# Altium schematic sheet Radio.SchDoc
size A3; DocumentNumber: 10; SheetNumber: 10; SheetTotal: 11
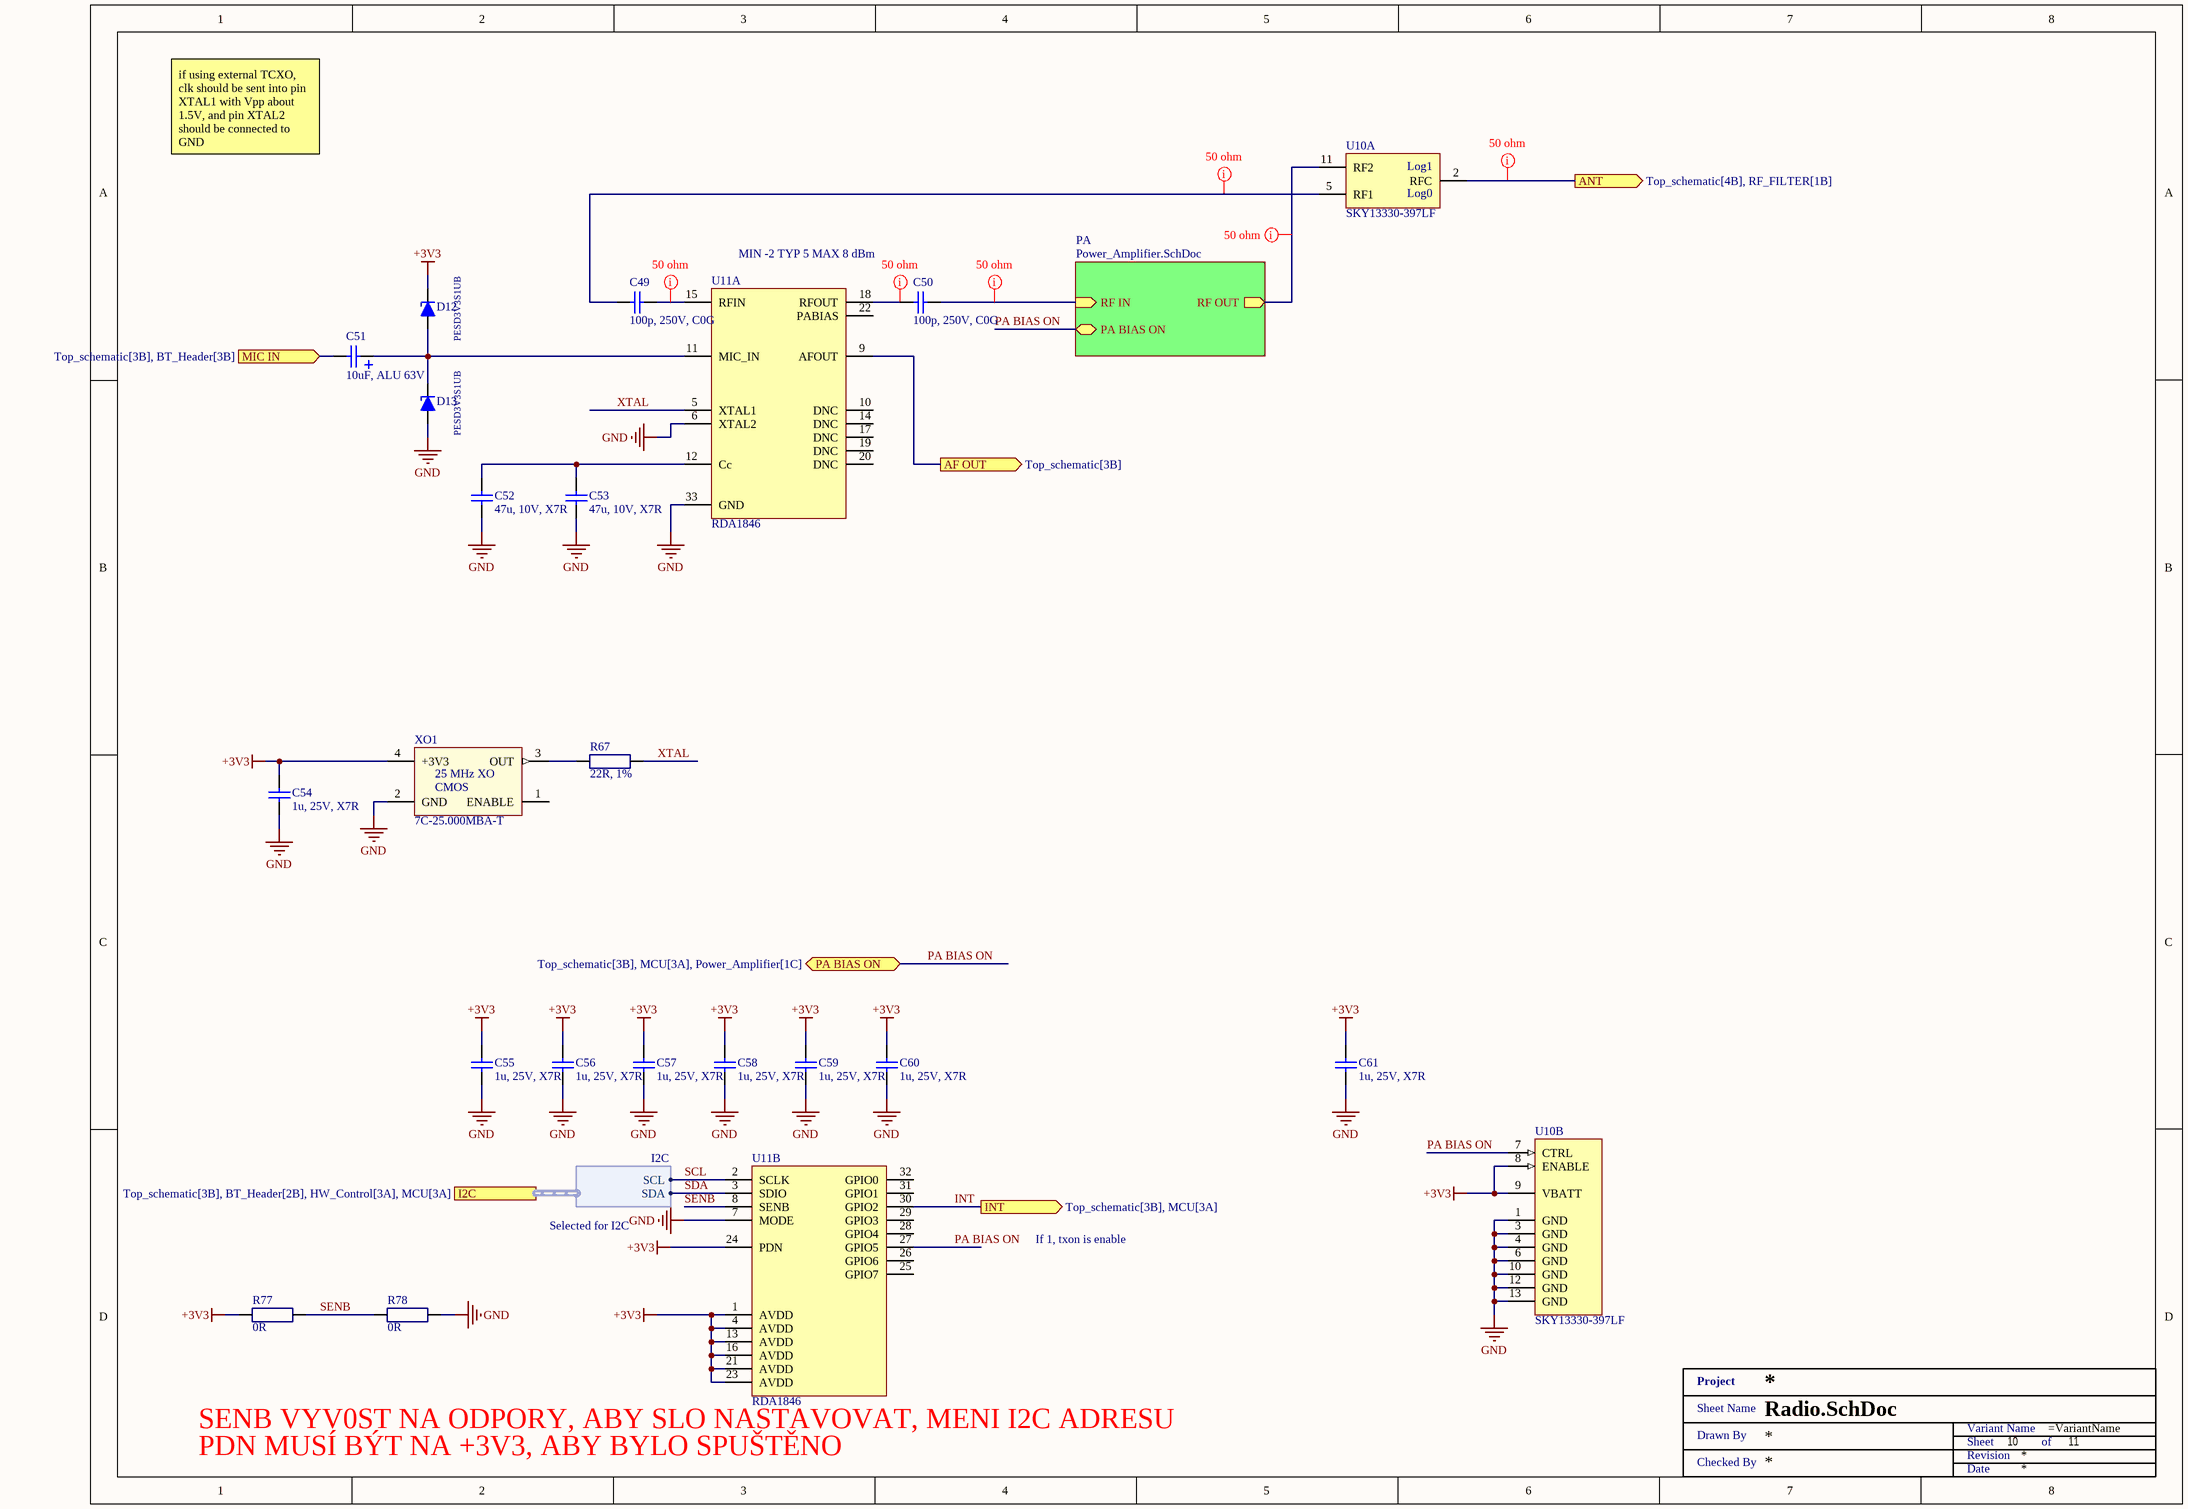
[diagram p0: Radio.SchDoc]

## Parts
C49  100p, 250V, C0G  [SMD0603]
C50  100p, 250V, C0G  [SMD0603]
C51  10uF, ALU 63V  [WCAP-ATLI_5x11x2]
C52  47u, 10V, X7R  [SMD1210]
C53  47u, 10V, X7R  [SMD1210]
C54  1u, 25V, X7R  [SMD0603]
C55  1u, 25V, X7R  [SMD0603]
C56  1u, 25V, X7R  [SMD0603]
C57  1u, 25V, X7R  [SMD0603]
C58  1u, 25V, X7R  [SMD0603]
C59  1u, 25V, X7R  [SMD0603]
C60  1u, 25V, X7R  [SMD0603]
C61  1u, 25V, X7R  [SMD0603]
D12  PESD3V3S1UB  [SOD523]
D13  PESD3V3S1UB  [SOD523]
R67  22R, 1%  [SMD0603 - R]
R77  0R  [SMD0603 - R]
R78  0R  [SMD0603 - R]
U10  SKY13330-397LF  [QFN50P200X200X100_HS-13N]  (parts A,B of 2)
U11  RDA1846  [QFN32-2]  (parts A,B of 2)
XO1  7C-25.000MBA-T  [ABRA-ABMM2-4_V]
XX?  Title 1  (value not drawn)  (graphical)

## Sub-sheets
PA = Power_Amplifier.SchDoc: PA BIAS ON (bidir), RF IN (in), RF OUT (out)

## Ports
AF OUT (out, see Top_schematic[3B]), ANT (out, see Top_schematic[4B], RF_FILTER[1B]), I2C (harness I2C, see Top_schematic[3B], BT_Header[2B], HW_Control[3A], MCU[3A]), INT (out, see Top_schematic[3B], MCU[3A]), MIC IN (in, see Top_schematic[3B], BT_Header[3B]), PA BIAS ON (bidir, see Top_schematic[3B], MCU[3A], Power_Amplifier[1C])

## Harnesses
I2C: SCL, SDA

## Nets
+3V3: C54.1 C55.1 C56.1 C57.1 C58.1 C59.1 C60.1 C61.1 D12.1(A) R77.1 U10.8(ENABLE) U10.9(VBATT) U11.1(AVDD) U11.4(AVDD) U11.13(AVDD) U11.16(AVDD) U11.21(AVDD) U11.23(AVDD) U11.24(PDN) XO1.4(+3V3)
GND: C52.1 C53.1 C54.2 C55.2 C56.2 C57.2 C58.2 C59.2 C60.2 C61.2 D13.2(K) R78.2 U10.1(GND) U10.3(GND) U10.4(GND) U10.6(GND) U10.10(GND) U10.12(GND) U10.13(GND) U11.6(XTAL2) U11.7(MODE) U11.33(GND) XO1.2(GND)
AF OUT: U11.9(AFOUT) ; port AF OUT
ANT: U10.2(RFC) ; port ANT
INT: U11.30(GPIO2) ; port INT
MIC IN: C51.2 ; port MIC IN
PA BIAS ON: U10.7(CTRL) U11.27(GPIO5) ; port PA BIAS ON, sheet PA/PA BIAS ON
SCL: U11.2(SCLK) ; port I2C.SCL
SDA: U11.3(SDIO) ; port I2C.SDA
SENB: R77.2 R78.1 U11.8(SENB)
XTAL: R67.2 U11.5(XTAL1)
NetC49_1: C49.1 U10.5(RF1)
NetC49_2: C49.2 U11.15(RFIN)
NetC50_1: C50.1 U11.18(RFOUT)
NetC50_2: C50.2 ; sheet PA/RF IN
NetC51_1: C51.1 D12.2(K) D13.1(A) U11.11(MIC_IN)
NetC52_2: C52.2 C53.2 U11.12(Cc)
NetR67_1: R67.1 XO1.3(OUT)
NetU10_11: U10.11(RF2) ; sheet PA/RF OUT

Not connected (* = marked no-connect by the designer): U11 10(DNC) 14(DNC) 17(DNC) 19(DNC) 20(DNC) 22(PABIAS) 25(GPIO7) 26(GPIO6) 28(GPIO4) 29(GPIO3) 31(GPIO1) 32(GPIO0); XO1 1(ENABLE)

## Layout directives
net class 50 ohm: ANT, NetC49_1, NetC49_2, NetC50_1, NetC50_2, NetU10_11

## Notes on the sheet
- if using external TCXO, clk should be sent into pin XTAL1 with Vpp about 1.5V, and pin XTAL2 should be connected to GND
- MIN -2 TYP 5 MAX 8 dBm
- Selected for I2C
- If 1, txon is enable
- (near U11) SENB VYV0ST NA ODPORY, ABY SLO NASTAVOVAT, MENI I2C ADRESU
- (near U11) PDN MUSÍ BÝT NA +3V3, ABY BYLO SPUŠTĚNO
- (in symbol 7C-25.000MBA-T) 25 MHz XO; CMOS
- (in symbol SKY13330-397LF, part A) Log1; Log0
- (in symbol Title 1) Project; Sheet Name; Variant Name; Drawn By; Sheet; of; Revision; Checked By; Date

## Library data of the parts
C49 C50 = 885342006003: CAP CER 100PF 250V C0G/NP0 0603; Manufacturer: Wurth Electronics Inc.; Tolerance: ±5%; Temperature Coefficient: C0G, NP0; Notification: Current market demand for these product types have resulted in fluctuating and extending lead times. Lead times may differ.; Supplier 1: Digi-Key; Supplier Part Number 1: 732-12167-1-ND; Manufacturer Part Number: 885342006003; RoHS: RoHS Compliant; Category: Capacitors; Stock 1: 43; Pricing 1: 1=0.1, 10=0.043, 100=0.0385, 500=0.03406 (USD); Packaging: Cut Tape (CT); Part Status: Active; Voltage - Rated: 250V; Operating Temperature: -55°C ~ 125°C; Features: -; Ratings: -; Applications: General Purpose; Failure Rate: -; Mounting Type: Surface Mount, MLCC; Package / Case: 0603 (1608 Metric); Size / Dimension: 0.063" L x 0.031" W (1.60mm x 0.80mm); Height - Seated (Max): -; Thickness (Max): 0.034" (0.87mm); Lead Spacing: -; Lead Style: -; ComponentLink1URL: https://katalog.we-online.de/pbs/datasheet/885342006003.pdf; ComponentLink1Description: https://katalog.we-online.de/pbs/datasheet/885342006003.pdf; Supplier 2: Farnell; Supplier Part Number 2: 2812519; Supplier 3: Mouser; Supplier Part Number 3: 710-885342006003; Capacitance: 100p
C51 = 860080772001: WURTH ELEKTRONIK - 860080772001 - CAP, ALU ELEC, 10UF, 63V, RADIAL; Ripple Current: 135mA @ 100kHz; Capacitance: 10u; Manufacturer: WURTH ELEKTRONIK; Manufacturer Part Number: 860080772001; RoHS: YES; Stock 1: 553; Pricing 1: 1=0.0957, 3=0.091, 5=0.0863, 10=0.0825, 20=0.0786, 50=0.0692, 250=0.0647, 500=0.0564 (GBP); ComponentLink1URL: http://www.farnell.com/datasheets/1879798.pdf; ComponentLink1Description: http://www.farnell.com/datasheets/1879798.pdf; Voltage Rating: 63V; Stock 3: 2136; Pricing 3: 1=0.62, 50=0.335, 100=0.289, 250=0.259, 500=0.235, 1500=0.202, 7500=0.182, 15000=0.178 (GBP); ComponentLink2URL: http://www.farnell.com/datasheets/2065186.pdf; ComponentLink2Description: http://www.farnell.com/datasheets/2065186.pdf; Supplier 1: Mouser; Supplier Part Number 1: 710-860080772001; Supplier 2: Farnell; Supplier Part Number 2: 2465955; Supplier 3: Digi-Key; Supplier Part Number 3: 732-9121-1-ND
C52 C53 = CL32B476MPJNNNE: Cap Ceramic 47uF 10V X7R 20% Pad SMD 1210 125C T/R; Manufacturer: Samsung; Supplier 1: Mouser; Supplier Part Number 1: 187-CL32B476MPJNNNE; Manufacturer Part Number: CL32B476MPJNNNE; RoHS: Yes; Category: Ceramic Capacitors; Stock 1: 61232; Pricing 1: 1=0.51, 10=0.377, 50=0.377, 100=0.263, 1000=0.198, 10000=0.163 (USD); Case/Package: 1210; Dielectric: X7R; Voltage Rating (DC): 10V; Tolerance: 20%; Value: 47uF; RoHS Compliant: Yes; ComponentLink1URL: http://www.samsungsem.com/kr/support/library/product-catalog/__icsFiles/afieldfile/2014/11/13/MLCC.pdf?src-supplier=Avnet; ComponentLink1Description: http://www.samsungsem.com/kr/support/library/product-catalog/__icsFiles/afieldfile/2014/11/13/MLCC.pdf?src-supplier=Avnet; Supplier 2: Arrow Electronics; Supplier Part Number 2: CL32B476MPJNNNE
C54-C61 = CGA3E1X7R1E105K080AC: CAP CER 1UF 25V X7R 0603; Manufacturer: TDK Corporation; Tolerance: ±10%; Manufacturer Part Number: CGA3E1X7R1E105K080AC; RoHS: RoHS Compliant; Category: Capacitors; Stock 1: 109509; Pricing 1: 1=0.2, 10=0.135, 100=0.0686, 500=0.04696, 1000=0.04154 (USD); Packaging: Cut Tape (CT); Part Status: Active; Voltage - Rated: 25V; Temperature Coefficient: X7R; Operating Temperature: -55°C ~ 125°C; Features: -; Ratings: AEC-Q200; Applications: Automotive; Failure Rate: -; Mounting Type: Surface Mount, MLCC; Package / Case: 0603 (1608 Metric); Size / Dimension: 0.063" L x 0.032" W (1.60mm x 0.80mm); Height - Seated (Max): -; Thickness (Max): 0.035" (0.90mm); Lead Spacing: -; Lead Style: -; ComponentLink1URL: https://product.tdk.com/info/en/catalog/datasheets/mlcc_automotive_general_en.pdf; ComponentLink1Description: https://product.tdk.com/info/en/catalog/datasheets/mlcc_automotive_general_en.pdf; Capacitance: 1u; Supplier 1: Mouser; Supplier Part Number 1: 810-CGA3E1X7R1E105K; Supplier 2: Farnell; Supplier Part Number 2: 2346962; Supplier 3: Digi-Key; Supplier Part Number 3: 445-6931-1-ND
D12 D13 = PESD3V3S1UB,115: TVS DIODE 3.3V 20V SOD523; Manufacturer: Nexperia USA Inc.; Type: Zener; Voltage - Reverse Standoff (Typ): 3.3V (Max); Voltage - Breakdown (Min): 5.2V; Current - Peak Pulse (10/1000µs): 18A (8/20µs); Power - Peak Pulse: 330W; Power Line Protection: No; Capacitance @ Frequency: 207pF @ 1MHz; Manufacturer Part Number: PESD3V3S1UB,115; RoHS: RoHS Compliant; Category: Circuit Protection; Stock 1: 0; Pricing 1: 1=0.49, 10=0.368, 100=0.2082, 500=0.1379, 1000=0.10573 (USD); Packaging: Cut Tape (CT); Part Status: Active; Voltage - Clamping (Max) @ Ipp: 20V; Applications: General Purpose; Operating Temperature: -65°C ~ 150°C (TA); Mounting Type: Surface Mount; Package / Case: SC-79, SOD-523; Supplier Device Package: SOD-523; Base Part Number: PESD*S1U; ComponentLink1URL: https://assets.nexperia.com/documents/data-sheet/PESDXS1UB_SERIES.pdf; ComponentLink1Description: https://assets.nexperia.com/documents/data-sheet/PESDXS1UB_SERIES.pdf; Supplier 1: Mouser; Supplier Part Number 1: 771-PESD3V3S1UB-T/R; Supplier 2: Farnell; Supplier Part Number 2: 8737568; Supplier 3: Digi-Key; Supplier Part Number 3: 1727-3829-1-ND; Supplier 4: TME; Supplier Part Number 4: PESD3V3S1UB.115
R67 = RC0603FR-0722RL: YAGEO (PHYCOMP) - RC0603FR-0722RL - RES, THICK FILM, 22R, 1%, 0.1W, 0603; Voltage Rating: 50; Resistor Case Style: 0603 [1608 Metric]; Power Rating: 100; Product Range: RC Series; Temperature Coefficient: ± 100; SVHC: No SVHC (20-Jun-2016); External Depth: 0.45; External Length / Height: 1.6; External Width: 0.8; Full Power Rating Temperature: 70; No. of Pins: 2; Reel Quantity: 5000; Resistor Mounting: Surface Mount Device; Voltage Rating V DC: 50V<!--FANDB--><div class="features-and-benefits-container"><div class="features-and-benefits-desc-container"><span class="features-and-benefits-container-desc">SMD Chip Resistor, Thick Film, 22 ohm, 50 V, 0603 [1608 Metric], 100 mW, ± 1%, RC Series</span></div><div class="features-and-benefits-description"><span class="features-benefits-value">The Yageo RC_L series resistors are general purpose thick film chip resistors with lead free terminations made by thick film process. The resistance range includes E24 and E96 decade values from 1ohm to 100Mohm. These resistors are constructed on top of a high grade ceramic body.</span></div><div class="features-and-benefits-list"><ul class="features-and-benefits-list-list"><li class="features-and-benefits-list-item">EIA 0075, 0100, 0201, 0402, 0603, 0805, 1206, 1210, 1218, 2010, 2512 case sizes available</li><li class="features-and-benefits-list-item">Small chip sizes save PCB space</li><li class="features-and-benefits-list-item">Rated voltage range of 10V to 200V</li><li class="features-and-benefits-list-item">Maximum power rating of 2W</li><li class="features-and-benefits-list-item">Available in ±0.1%, ±0.5%, ±1% and ±5% tolerance</li><li class="features-and-benefits-list-item">High component and equipment reliability</li><li class="features-and-benefits-list-item">Forbidden materials are not used in products/production</li><li class="features-and-benefits-list-item">-55°C to 155°C temperature range for RC0402 to RC2512 and -55°C to 125°C for RC0075 to RC0201; Manufacturer: YAGEO (PHYCOMP); Manufacturer Part Number: RC0603FR-0722RL; RoHS: YES; Stock 1: 33025; Pricing 1: 10=0.0102, 100=0.0068, 500=0.0051, 1000=0.0041, 2500=0.0034 (GBP); Resistance: 22R; Resistance Tolerance: ± 1%; Packaging: Cut Tape; Resistor Element Material: Thick Film; Automotive Qualification Standard: -; MSL: MSL 1 - Unlimited; Operating Temperature Max: 155; Operating Temperature Min: -55; Operating Temperature Range: -55°C to +155; Temperature Coeff. +: 100; Temperature Coeff. -: 100; Tolerance +: 1%; Tolerance -: 1%; ComponentLink1URL: http://www.farnell.com/datasheets/2167052.pdf; ComponentLink1Description: http://www.farnell.com/datasheets/2167052.pdf; ComponentLink2URL: http://www.farnell.com/cad/1555248.zip; ComponentLink2Description: http://www.farnell.com/cad/1555248.zip; Supplier 1: Mouser; Supplier Part Number 1: 603-RC0603FR-0722RL; Supplier 2: Farnell; Supplier Part Number 2: 9238280; Supplier 3: Digi-Key; Supplier Part Number 3: 311-22.0HRCT-ND
R77 R78 = CRCW06030000Z0EA: RES SMD 0 OHM JUMPER 1/10W 0603; Manufacturer: Vishay Dale; Power (Watts): 0.1W, 1/10W; Manufacturer Part Number: CRCW06030000Z0EA; RoHS: RoHS Compliant; Category: Resistors; Stock 1: 0; Pricing 1: 1=0.1, 10=0.028, 25=0.0204, 50=0.0154, 100=0.0114, 250=0.00868, 500=0.00694, 1000=0.00511 (USD); Packaging: Cut Tape (CT); Part Status: Active; Tolerance: Jumper; Composition: Thick Film; Features: Automotive AEC-Q200; Temperature Coefficient: -; Operating Temperature: -55°C ~ 155°C; Package / Case: 0603 (1608 Metric); Supplier Device Package: 0603; Size / Dimension: 0.063" L x 0.033" W (1.60mm x 0.85mm); Height - Seated (Max): 0.020" (0.50mm); Failure Rate: -; ComponentLink1URL: http://www.vishay.com/docs/20035/dcrcwe3.pdf; ComponentLink1Description: http://www.vishay.com/docs/20035/dcrcwe3.pdf; Resistance: 0R; Supplier 1: Mouser; Supplier Part Number 1: 71-CRCW0603-0-E3; Supplier 2: Farnell; Supplier Part Number 2: 1469739; Supplier 3: Digi-Key; Supplier Part Number 3: 541-0.0GCT-ND
U10 = SKY13330-397LF: RF Switch SP2T 100MHz to 6GHz 16dB Automotive 12-Pin QFN EP; Manufacturer: Skyworks Solutions; Throw Configuration: SPDT; P1dB: 39dBm; Impedance: 50R; Insertion Loss: 0.65dB; Turn-Off Delay Time: 1.6us; Supplier 1: Mouser; Supplier Part Number 1: 873-SKY13330-397LF; Manufacturer Part Number: SKY13330-397LF; RoHS: Yes; Category: RF Semiconductors and Devices; Pricing 1: 1=1.02000, 10=0.86600, 50=0.86600, 100=0.66600, 500=0.58800, 1000=0.46500, 3000=0.43000, 10000=0.43000 (USD); Mount: Surface Mount; Case/Package: QFN; Number of Pins: 12; Contact Plating: Tin,Matte; Weight: 0.000776oz; Min Operating Temperature: -40°C; Max Operating Temperature: 85°C; Frequency: 100MHz; Packaging: Tape and Reel; Package Quantity: 3000; Turn-On Delay Time: 1.6us; Max Frequency: 6GHz; Radiation Hardening: No; ComponentLink1URL: https://datasheet.ciiva.com/15100/getdatasheetpartid-656010-15100460.pdf?src-supplier=Verical; ComponentLink1Description: https://datasheet.ciiva.com/15100/getdatasheetpartid-656010-15100460.pdf?src-supplier=Verical; Supplier 2: Digi-Key; Supplier Part Number 2: 863-1643-2-ND; Supplier 3: Arrow Electronics; Supplier Part Number 3: SKY13330-397LF
U11 = RDA1846: SINGLE CHIP TRANSCEIVER FOR WALKIE TALKIE
XO1 = 7C-25.000MBA-T: Oscillator XO 25MHz ±25ppm CMOS 60% 3.3V 4-Pin SMD T/R; Manufacturer: TXC; Max Supply Current: 30mA; Supplier 1: Mouser; Supplier Part Number 1: 717-7C-25.000MBA-T; Manufacturer Part Number: 7C-25.000MBA-T; RoHS: Yes; Category: Oscillators; Stock 1: 438; Pricing 1: 1=2.43000, 10=2.37000, 50=2.25000, 100=1.97000, 1000=1.51000, 10000=1.38000 (USD); Mount: Surface Mount; Case/Package: SMD/SMT; Min Operating Temperature: -10°C; Max Operating Temperature: 70°C; Termination: SMD/SMT; Package Quantity: 1000; Packaging: Tape and Reel; Frequency: 25MHz; Frequency Stability: 25ppm; Operating Supply Voltage: 3.3V; Length: 0.197inch; Width: 0.126inch; Height: 0.055inch; Depth: 3.2mm; REACH SVHC: No SVHC; ComponentLink1URL: https://datasheet.ciiva.com/866/7c-tight-866555.pdf?src-supplier=Digi-Key; ComponentLink1Description: https://datasheet.ciiva.com/866/7c-tight-866555.pdf?src-supplier=Digi-Key; ComponentLink2URL: https://datasheet.ciiva.com/866/7c-tight-866557.pdf?src-supplier=Digi-Key; ComponentLink2Description: https://datasheet.ciiva.com/866/7c-tight-866557.pdf?src-supplier=Digi-Key; ComponentLink3URL: https://datasheet.ciiva.com/1357/1363553-1357832.pdf?src-supplier=Element14; ComponentLink3Description: https://datasheet.ciiva.com/1357/1363553-1357832.pdf?src-supplier=Element14; ComponentLink4URL: https://datasheet.ciiva.com/866/7c-tight-866556.pdf?src-supplier=Digi-Key; ComponentLink4Description: https://datasheet.ciiva.com/866/7c-tight-866556.pdf?src-supplier=Digi-Key; ComponentLink5URL: https://datasheet.ciiva.com/1365/7c-1365613.pdf?src-supplier=Farnell; ComponentLink5Description: https://datasheet.ciiva.com/1365/7c-1365613.pdf?src-supplier=Farnell; Supplier 2: Farnell; Supplier Part Number 2: 1842030; Supplier 3: Digi-Key; Supplier Part Number 3: 887-1389-1-ND